# Altium schematic sheet CTL_RELAY_CCU_HAS.SchDoc
size A
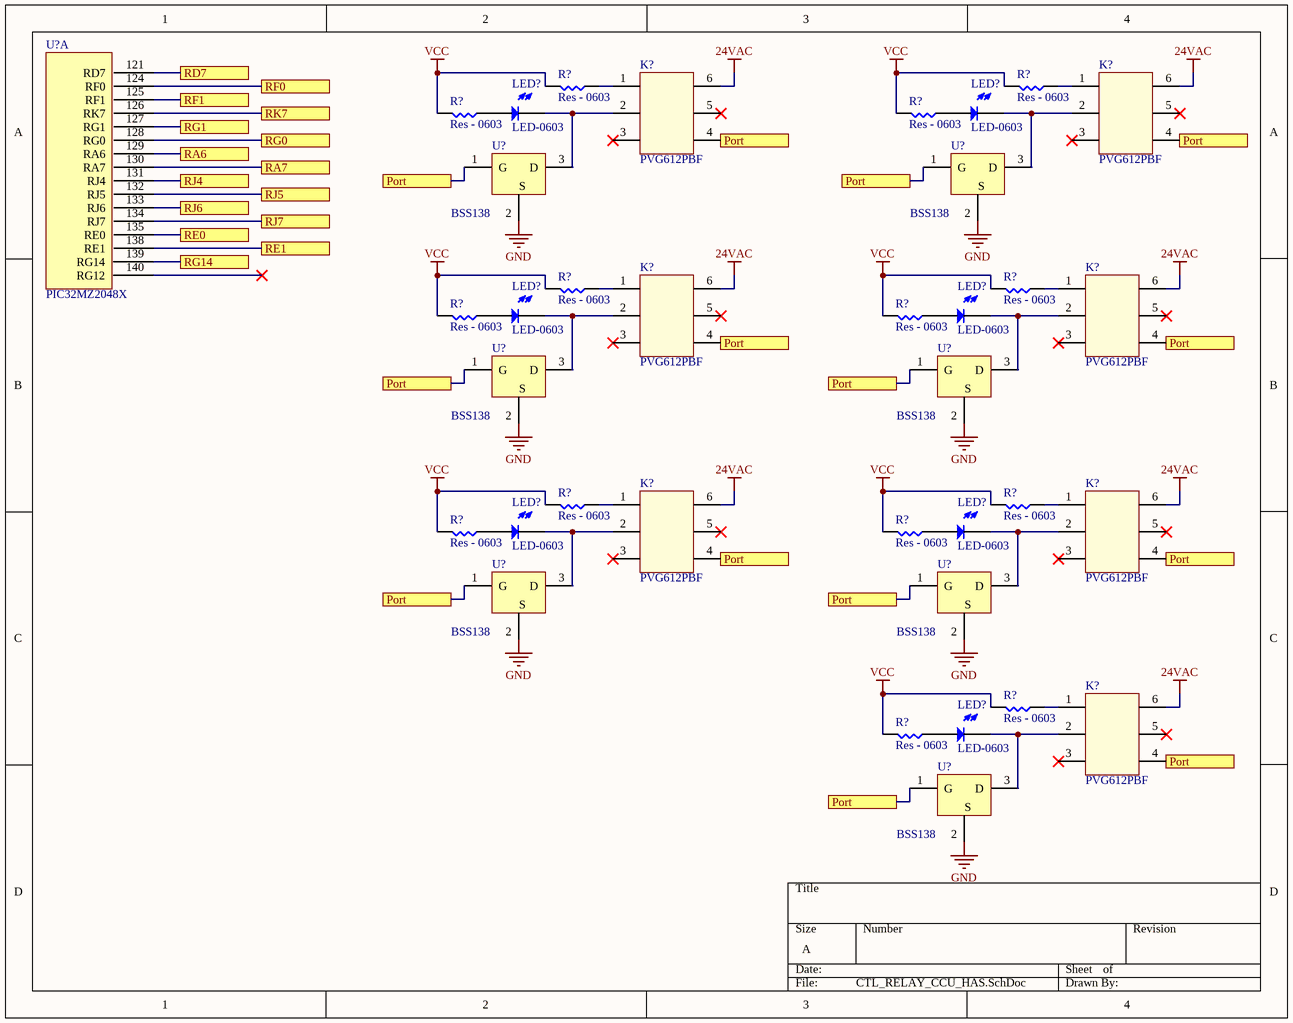
[diagram p0: CTL_RELAY_CCU_HAS.SchDoc]

## Parts
(Parts that share a designator on the sheet are numbered #1, #2 ... from top to bottom, then left to right.)
K?#1  PVG612PBF  [PVG612PBF]
K?#2  PVG612PBF  [PVG612PBF]
K?#3  PVG612PBF  [PVG612PBF]
K?#4  PVG612PBF  [PVG612PBF]
K?#5  PVG612PBF  [PVG612PBF]
K?#6  PVG612PBF  [PVG612PBF]
K?#7  PVG612PBF  [PVG612PBF]
LED?#1  LED-0603  [LED-0603]
LED?#2  LED-0603  [LED-0603]
LED?#3  LED-0603  [LED-0603]
LED?#4  LED-0603  [LED-0603]
LED?#5  LED-0603  [LED-0603]
LED?#6  LED-0603  [LED-0603]
LED?#7  LED-0603  [LED-0603]
R?#1  Res - 0603  [NonPolar-0603]
R?#2  Res - 0603  [NonPolar-0603]
R?#3  Res - 0603  [NonPolar-0603]
R?#4  Res - 0603  [NonPolar-0603]
R?#5  Res - 0603  [NonPolar-0603]
R?#6  Res - 0603  [NonPolar-0603]
R?#7  Res - 0603  [NonPolar-0603]
R?#8  Res - 0603  [NonPolar-0603]
R?#9  Res - 0603  [NonPolar-0603]
R?#10  Res - 0603  [NonPolar-0603]
R?#11  Res - 0603  [NonPolar-0603]
R?#12  Res - 0603  [NonPolar-0603]
R?#13  Res - 0603  [NonPolar-0603]
R?#14  Res - 0603  [NonPolar-0603]
U?#1  PIC32MZ2048X  [PIC32MZ-FlatPack-144 Pin]  (part A of 2)
U?#2  BSS138  [BSS138-SOT23]
U?#3  BSS138  [BSS138-SOT23]
U?#4  BSS138  [BSS138-SOT23]
U?#5  BSS138  [BSS138-SOT23]
U?#6  BSS138  [BSS138-SOT23]
U?#7  BSS138  [BSS138-SOT23]
U?#8  BSS138  [BSS138-SOT23]

## Ports
Port, RA6, RA7, RD7, RE0, RE1, RF0, RF1, RG0, RG1, RG14, RJ4, RJ5, RJ6, RJ7, RK7

## Nets
24VAC: K?#1.6 K?#2.6 K?#3.6 K?#4.6 K?#5.6 K?#6.6 K?#7.6
GND: U?#2.2(S) U?#3.2(S) U?#4.2(S) U?#5.2(S) U?#6.2(S) U?#7.2(S) U?#8.2(S)
VCC: R?#1.1 R?#2.1 R?#3.1 R?#4.1 R?#5.1 R?#6.1 R?#7.1 R?#8.1 R?#9.1 R?#10.1 R?#11.1 R?#12.1 R?#13.1 R?#14.1
Port: K?#1.4 K?#2.4 K?#3.4 K?#4.4 K?#5.4 K?#6.4 K?#7.4 U?#2.1(G) U?#3.1(G) U?#4.1(G) U?#5.1(G) U?#6.1(G) U?#7.1(G) U?#8.1(G) ; port Port
RA6: U?#1.129(RA6) ; port RA6
RA7: U?#1.130(RA7) ; port RA7
RD7: U?#1.121(RD7) ; port RD7
RE0: U?#1.135(RE0) ; port RE0
RE1: U?#1.138(RE1) ; port RE1
RF0: U?#1.124(RF0) ; port RF0
RF1: U?#1.125(RF1) ; port RF1
RG0: U?#1.128(RG0) ; port RG0
RG1: U?#1.127(RG1) ; port RG1
RG14: U?#1.139(RG14) ; port RG14
RJ4: U?#1.131(RJ4) ; port RJ4
RJ5: U?#1.132(RJ5) ; port RJ5
RJ6: U?#1.133(RJ6) ; port RJ6
RJ7: U?#1.134(RJ7) ; port RJ7
RK7: U?#1.126(RK7) ; port RK7
NetK?#1_1: K?#1.1 R?#1.2
NetK?#1_2: K?#1.2 LED?#1.2 U?#2.3(D)
NetK?#2_1: K?#2.1 R?#2.2
NetK?#2_2: K?#2.2 LED?#2.2 U?#3.3(D)
NetK?#3_1: K?#3.1 R?#5.2
NetK?#3_2: K?#3.2 LED?#3.2 U?#4.3(D)
NetK?#4_1: K?#4.1 R?#6.2
NetK?#4_2: K?#4.2 LED?#4.2 U?#5.3(D)
NetK?#5_1: K?#5.1 R?#9.2
NetK?#5_2: K?#5.2 LED?#5.2 U?#6.3(D)
NetK?#6_1: K?#6.1 R?#10.2
NetK?#6_2: K?#6.2 LED?#6.2 U?#7.3(D)
NetK?#7_1: K?#7.1 R?#13.2
NetK?#7_2: K?#7.2 LED?#7.2 U?#8.3(D)
NetLED?#1_1: LED?#1.1 R?#3.2
NetLED?#2_1: LED?#2.1 R?#4.2
NetLED?#3_1: LED?#3.1 R?#7.2
NetLED?#4_1: LED?#4.1 R?#8.2
NetLED?#5_1: LED?#5.1 R?#11.2
NetLED?#6_1: LED?#6.1 R?#12.2
NetLED?#7_1: LED?#7.1 R?#14.2

Not connected (* = marked no-connect by the designer): K?#1 3(18)* 5(14)*; K?#2 3(18)* 5(14)*; K?#3 3(18)* 5(14)*; K?#4 3(18)* 5(14)*; K?#5 3(18)* 5(14)*; K?#6 3(18)* 5(14)*; K?#7 3(18)* 5(14)*; U?#1 140(RG12)*

## Library data of the parts
K?#1-K?#7 = PVG612PBF: PhotoVoltaic Relay